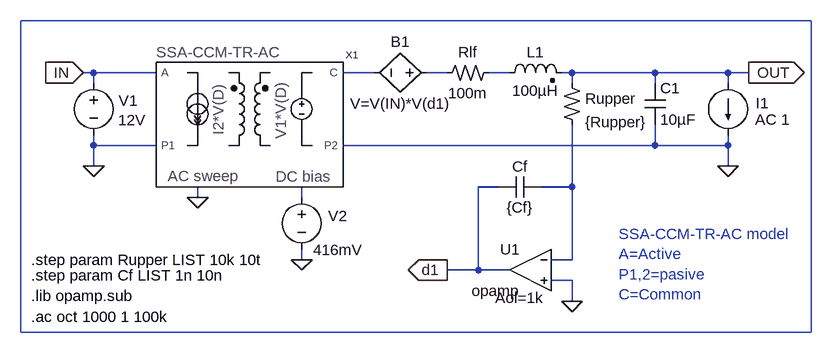
[diagram p0: schematic Switch-Mode Power Supplies - Basso- Figure 2-12C.asc]
Switch-Mode Power Supplies - Basso- Figure 2-12C.asc, the LTspice schematic file:
Version 4
SHEET 1 1556 1876
WIRE -256 -32 -272 -32
WIRE -160 -32 -256 -32
WIRE 176 -32 128 -32
WIRE 288 -32 256 -32
WIRE 384 -32 352 -32
WIRE 480 -32 464 -32
WIRE 608 -32 480 -32
WIRE 720 -32 608 -32
WIRE 752 -32 720 -32
WIRE -256 -16 -256 -32
WIRE 480 -16 480 -32
WIRE 608 -16 608 -32
WIRE 720 -16 720 -32
WIRE -256 80 -256 64
WIRE -160 80 -256 80
WIRE 608 80 608 48
WIRE 608 80 128 80
WIRE 720 80 720 64
WIRE 720 80 608 80
WIRE -256 112 -256 80
WIRE 720 112 720 80
WIRE 368 144 336 144
WIRE 480 144 480 48
WIRE 480 144 432 144
WIRE -96 160 -96 144
WIRE 64 160 64 144
WIRE 64 256 64 240
WIRE 480 256 480 144
WIRE 480 256 448 256
WIRE 336 272 336 144
WIRE 336 272 288 272
WIRE 384 272 336 272
WIRE 480 288 448 288
WIRE 480 320 480 288
FLAG -256 112 0
FLAG 64 256 0
FLAG 752 -32 OUT
IOPIN 752 -32 Out
FLAG -272 -32 IN
IOPIN -272 -32 In
FLAG 720 112 0
FLAG 480 320 0
FLAG 288 272 d1
IOPIN 288 272 Out
FLAG -96 160 0
SYMBOL voltage -256 -32 R0
WINDOW 123 0 0 Left 0
WINDOW 39 0 0 Left 0
WINDOW 0 39 43 Left 0
WINDOW 3 38 73 Left 0
SYMATTR InstName V1
SYMATTR Value 12V
SYMBOL voltage 64 144 R0
WINDOW 123 24 132 Left 0
WINDOW 39 0 0 Left 0
WINDOW 0 41 45 Left 0
WINDOW 3 18 97 Left 0
SYMATTR InstName V2
SYMATTR Value 416mV
SYMBOL ind2 368 -16 R270
WINDOW 0 32 56 VTop 0
WINDOW 3 4 56 VBottom 0
SYMATTR InstName L1
SYMATTR Value 100µH
SYMBOL cap 592 -16 R0
SYMATTR InstName C1
SYMATTR Value 10µF
SYMBOL res2 352 -48 R90
WINDOW 0 0 32 VBottom 0
WINDOW 3 32 32 VTop 0
SYMATTR InstName Rlf
SYMATTR Value 100m
SYMBOL bv 272 -32 R90
WINDOW 0 -32 56 VBottom 0
WINDOW 3 32 56 VTop 0
SYMATTR InstName B1
SYMATTR Value V=V(IN)*V(d1)
SYMBOL res2 464 -16 R0
SYMATTR InstName Rupper
SYMATTR Value {Rupper}
SYMBOL cap 432 128 R90
WINDOW 0 0 32 VBottom 0
WINDOW 3 32 32 VTop 0
SYMATTR InstName Cf
SYMATTR Value {Cf}
SYMBOL current 720 -16 R0
WINDOW 123 42 56 Left 0
WINDOW 39 0 0 Left 0
WINDOW 0 43 31 Left 0
SYMATTR Value2 AC 1
SYMATTR InstName I1
SYMATTR Value ""
SYMBOL Opamps\\opamp 416 208 M0
WINDOW 39 -20 107 Left 0
SYMATTR SpiceLine Aol=1k
SYMATTR InstName U1
SYMATTR SpiceLine2 GBW=10G
SYMBOL SSA-CCM-TR-AC -16 128 R0
SYMATTR InstName X1
TEXT -352 344 Left 0 !.ac oct 1000 1 100k
TEXT -352 312 Left 0 !.lib opamp.sub
TEXT 552 216 Left 0 ;SSA-CCM-TR-AC model\nA=Active\nP1,2=pasive\nC=Common
TEXT -352 280 Left 0 !.step param Cf LIST 1n 10n
TEXT -352 256 Left 0 !.step param Rupper LIST 10k 10t
RECTANGLE Normal 848 368 -368 -112

The netlist it stands for:
* Switch-Mode Power Supplies - Basso- Figure 2-12C.asc
V1 IN 0 12V
V2 N005 0 416mV
L1 N003 OUT 100µH
C1 OUT 0 10µF
Rlf N003 N002 100m
B1 N002 N001 V=V(IN)*V(d1)
Rupper OUT N004 {Rupper}
Cf N004 d1 {Cf}
I1 OUT 0 AC 1
XU1 N004 0 d1 opamp Aol=1k GBW=10G  ; pins invin noninvin out
XX1 IN 0 N005 N001 0 0 SSA-CCM-TR-AC  ; pins A P1 D C P2 AC
.ac oct 1000 1 100k
.lib opamp.sub
* SSA-CCM-TR-AC model
* A=Active
* P1,2=pasive
* C=Common
.step param Cf LIST 1n 10n
.step param Rupper LIST 10k 10t
.backanno
.end